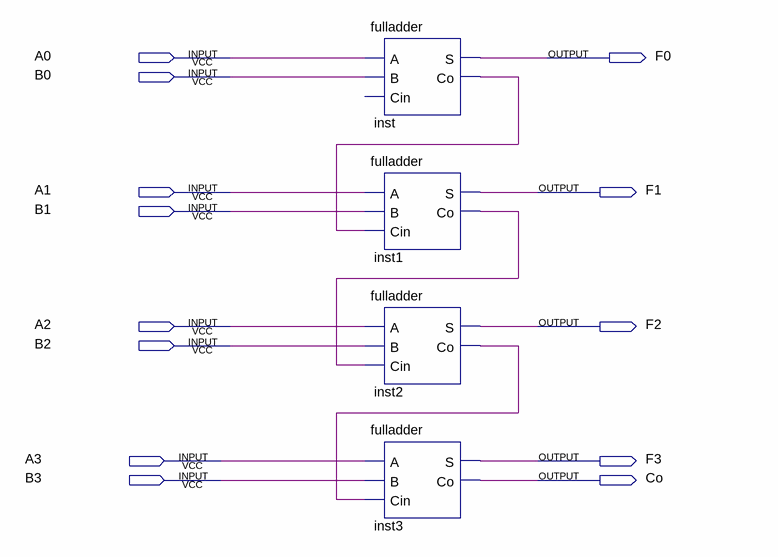
[diagram p0: schematic sheet]
// Quartus schematic fourfulladder.bdf as structural Verilog: 4 symbols, 13 pins
module fourfulladder (
  input  A0,
  input  B0,
  input  A1,
  input  B1,
  input  A2,
  input  B2,
  input  A3,
  input  B3,
  output F0,
  output F1,
  output F2,
  output F3,
  output Co
);

  wire inst1_co, inst2_co, inst_co;

  fulladder inst (.A(A0), .B(B0), .S(F0), .Co(inst_co));  // open: Cin
  fulladder inst1 (.A(A1), .B(B1), .Cin(inst_co), .S(F1), .Co(inst1_co));
  fulladder inst2 (.A(A2), .B(B2), .Cin(inst1_co), .S(F2), .Co(inst2_co));
  fulladder inst3 (.A(A3), .B(B3), .Cin(inst2_co), .S(F3), .Co(Co));
endmodule
